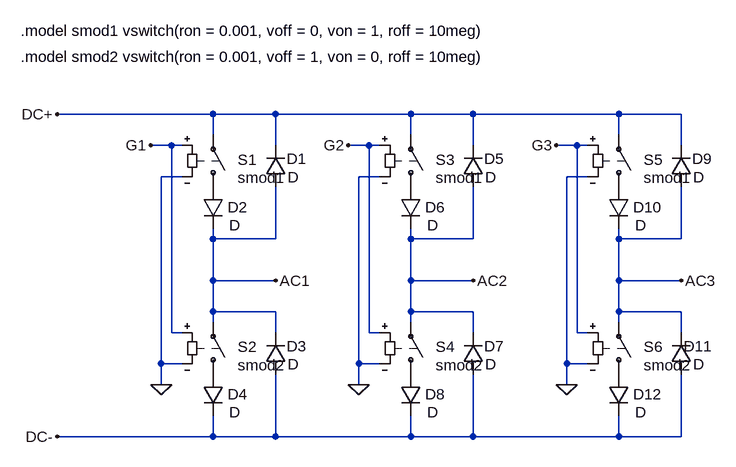
[diagram p0: schematic IDEAL_B6CI.asc]
IDEAL_B6CI.asc, the LTspice schematic file:
Version 4
SHEET 1 1000 680
WIRE 208 48 -32 48
WIRE 304 48 208 48
WIRE 512 48 304 48
WIRE 608 48 512 48
WIRE 832 48 608 48
WIRE 928 48 832 48
WIRE 208 80 208 48
WIRE 512 80 512 48
WIRE 832 80 832 48
WIRE 144 96 112 96
WIRE 160 96 144 96
WIRE 304 96 304 48
WIRE 448 96 416 96
WIRE 464 96 448 96
WIRE 608 96 608 48
WIRE 768 96 736 96
WIRE 784 96 768 96
WIRE 928 96 928 48
WIRE 160 144 128 144
WIRE 464 144 432 144
WIRE 784 144 752 144
WIRE 208 240 208 224
WIRE 304 240 304 160
WIRE 304 240 208 240
WIRE 512 240 512 224
WIRE 608 240 608 160
WIRE 608 240 512 240
WIRE 832 240 832 224
WIRE 928 240 928 160
WIRE 928 240 832 240
WIRE 208 304 208 240
WIRE 304 304 208 304
WIRE 512 304 512 240
WIRE 608 304 512 304
WIRE 832 304 832 240
WIRE 928 304 832 304
WIRE 208 352 208 304
WIRE 304 352 208 352
WIRE 512 352 512 304
WIRE 608 352 512 352
WIRE 832 352 832 304
WIRE 928 352 832 352
WIRE 208 368 208 352
WIRE 512 368 512 352
WIRE 832 368 832 352
WIRE 144 384 144 96
WIRE 160 384 144 384
WIRE 304 384 304 352
WIRE 448 384 448 96
WIRE 464 384 448 384
WIRE 608 384 608 352
WIRE 768 384 768 96
WIRE 784 384 768 384
WIRE 928 384 928 352
WIRE 128 432 128 144
WIRE 160 432 128 432
WIRE 432 432 432 144
WIRE 464 432 432 432
WIRE 752 432 752 144
WIRE 784 432 752 432
WIRE 128 464 128 432
WIRE 432 464 432 432
WIRE 752 464 752 432
WIRE 208 544 208 512
WIRE 208 544 -32 544
WIRE 304 544 304 448
WIRE 304 544 208 544
WIRE 512 544 512 512
WIRE 512 544 304 544
WIRE 608 544 608 448
WIRE 608 544 512 544
WIRE 832 544 832 512
WIRE 832 544 608 544
WIRE 928 544 928 448
WIRE 928 544 832 544
FLAG 112 96 G1
FLAG 304 304 AC1
FLAG 128 464 0
FLAG 416 96 G2
FLAG 608 304 AC2
FLAG 432 464 0
FLAG 736 96 G3
FLAG 928 304 AC3
FLAG 752 464 0
FLAG -32 48 DC+
FLAG -32 544 DC-
SYMBOL sw 208 176 M180
WINDOW 3 38 30 Left 2
WINDOW 0 38 58 Left 2
SYMATTR Value smod1
SYMATTR InstName S1
SYMBOL diode 320 160 R180
WINDOW 0 -32 43 Left 2
WINDOW 3 -20 15 Left 2
SYMATTR InstName D1
SYMBOL diode 192 160 R0
WINDOW 0 38 31 Left 2
WINDOW 3 41 59 Left 2
SYMATTR InstName D2
SYMBOL sw 208 464 M180
WINDOW 3 38 30 Left 2
WINDOW 0 38 58 Left 2
SYMATTR Value smod2
SYMATTR InstName S2
SYMBOL diode 320 448 R180
WINDOW 0 -32 43 Left 2
WINDOW 3 -20 15 Left 2
SYMATTR InstName D3
SYMBOL diode 192 448 R0
WINDOW 0 38 31 Left 2
WINDOW 3 41 59 Left 2
SYMATTR InstName D4
SYMBOL sw 512 176 M180
WINDOW 3 38 30 Left 2
WINDOW 0 38 58 Left 2
SYMATTR Value smod1
SYMATTR InstName S3
SYMBOL diode 624 160 R180
WINDOW 0 -32 43 Left 2
WINDOW 3 -20 15 Left 2
SYMATTR InstName D5
SYMBOL diode 496 160 R0
WINDOW 0 38 31 Left 2
WINDOW 3 41 59 Left 2
SYMATTR InstName D6
SYMBOL sw 512 464 M180
WINDOW 3 38 30 Left 2
WINDOW 0 38 58 Left 2
SYMATTR Value smod2
SYMATTR InstName S4
SYMBOL diode 624 448 R180
WINDOW 0 -32 43 Left 2
WINDOW 3 -20 15 Left 2
SYMATTR InstName D7
SYMBOL diode 496 448 R0
WINDOW 0 38 31 Left 2
WINDOW 3 41 59 Left 2
SYMATTR InstName D8
SYMBOL sw 832 176 M180
WINDOW 3 38 30 Left 2
WINDOW 0 38 58 Left 2
SYMATTR Value smod1
SYMATTR InstName S5
SYMBOL diode 944 160 R180
WINDOW 0 -32 43 Left 2
WINDOW 3 -20 15 Left 2
SYMATTR InstName D9
SYMBOL diode 816 160 R0
WINDOW 0 38 31 Left 2
WINDOW 3 41 59 Left 2
SYMATTR InstName D10
SYMBOL sw 832 464 M180
WINDOW 3 38 30 Left 2
WINDOW 0 38 58 Left 2
SYMATTR Value smod2
SYMATTR InstName S6
SYMBOL diode 944 448 R180
WINDOW 0 -32 43 Left 2
WINDOW 3 -20 15 Left 2
SYMATTR InstName D11
SYMBOL diode 816 448 R0
WINDOW 0 38 31 Left 2
WINDOW 3 41 59 Left 2
SYMATTR InstName D12
TEXT -88 -80 Left 2 !.model smod1 vswitch(ron = 0.001, voff = 0, von = 1, roff = 10meg)
TEXT -88 -40 Left 2 !.model smod2 vswitch(ron = 0.001, voff = 1, von = 0, roff = 10meg)

The netlist it stands for:
* IDEAL_B6CI.asc
S1 P001 DC+ G1 0 smod1
D1 AC1 DC+ D
D2 P001 AC1 D
S2 P002 AC1 G1 0 smod2
D3 DC- AC1 D
D4 P002 DC- D
S3 P003 DC+ G2 0 smod1
D5 AC2 DC+ D
D6 P003 AC2 D
S4 P004 AC2 G2 0 smod2
D7 DC- AC2 D
D8 P004 DC- D
S5 P005 DC+ G3 0 smod1
D9 AC3 DC+ D
D10 P005 AC3 D
S6 P006 AC3 G3 0 smod2
D11 DC- AC3 D
D12 P006 DC- D
.model D D
.lib standard.dio
.model smod1 vswitch(ron = 0.001, voff = 0, von = 1, roff = 10meg)
.model smod2 vswitch(ron = 0.001, voff = 1, von = 0, roff = 10meg)
.backanno
.end